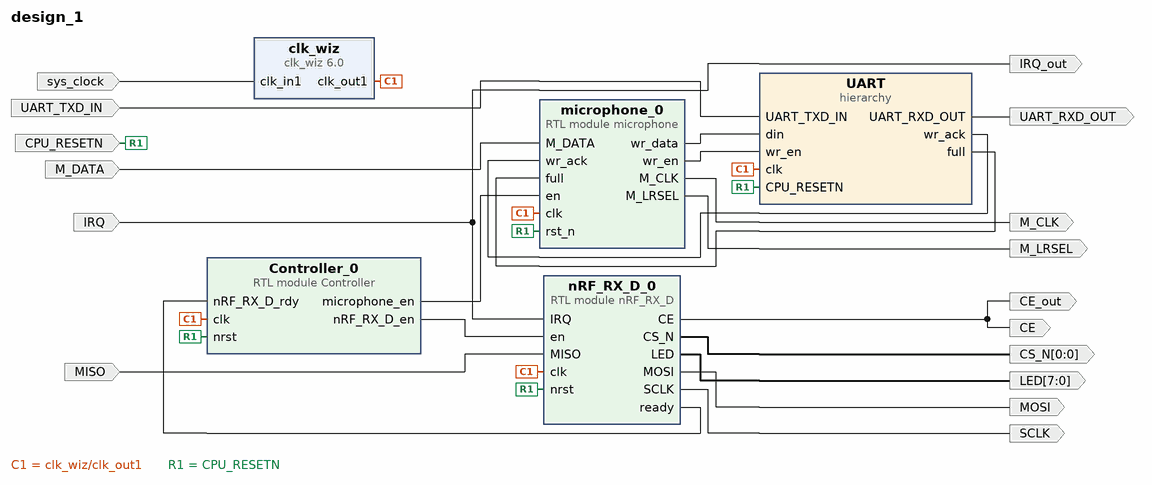
[diagram p0: block diagram of the top level]
# Vivado block design design_1, xc7a100tcsg324-1, Vivado 2020.2
create_bd_design design_1

create_bd_port -dir O UART_RXD_OUT
create_bd_port -dir I UART_TXD_IN
create_bd_port -dir I M_DATA
create_bd_port -dir O -type clk M_CLK
create_bd_port -dir O M_LRSEL
create_bd_port -dir I -type clk sys_clock
set_property -dict {CONFIG.FREQ_HZ 100000000 CONFIG.PHASE 0.000} [get_bd_ports sys_clock]
create_bd_port -dir I -type rst CPU_RESETN
create_bd_port -dir O -from 7 -to 0 LED
create_bd_port -dir O CE
create_bd_port -dir O -from 0 -to 0 CS_N
create_bd_port -dir I -type intr IRQ
create_bd_port -dir I MISO
create_bd_port -dir O MOSI
create_bd_port -dir O SCLK
create_bd_port -dir O IRQ_out
create_bd_port -dir O CE_out

create_bd_cell -type module -reference Controller Controller_0
create_bd_cell -type module -reference microphone microphone_0
create_bd_cell -type ip -vlnv xilinx.com:ip:clk_wiz:6.0 clk_wiz
set_property -dict [list \
  CONFIG.CLK_IN1_BOARD_INTERFACE sys_clock \
  CONFIG.USE_BOARD_FLOW true \
  CONFIG.USE_LOCKED false \
  CONFIG.USE_RESET false \
] [get_bd_cells clk_wiz]
create_bd_cell -type module -reference nRF_RX_D nRF_RX_D_0
create_bd_cell -type hier UART

# ---- hierarchy /UART ----
current_bd_instance /UART
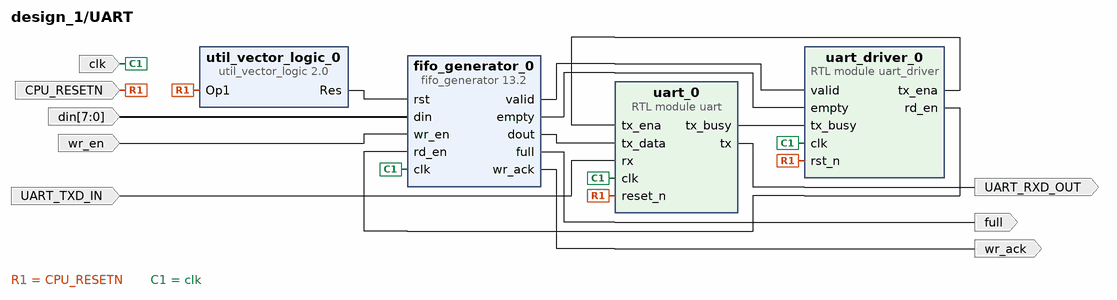
[diagram p1: block diagram inside /UART]
create_bd_pin -dir I -type rst CPU_RESETN
create_bd_pin -dir I -type clk clk
create_bd_pin -dir I -from 7 -to 0 din
create_bd_pin -dir I wr_en
create_bd_pin -dir O full
create_bd_pin -dir O wr_ack
create_bd_pin -dir I UART_TXD_IN
create_bd_pin -dir O UART_RXD_OUT

create_bd_cell -type ip -vlnv xilinx.com:ip:util_vector_logic:2.0 util_vector_logic_0
set_property -dict {CONFIG.C_OPERATION not CONFIG.C_SIZE 1} [get_bd_cells util_vector_logic_0]
create_bd_cell -type module -reference uart_driver uart_driver_0
create_bd_cell -type ip -vlnv xilinx.com:ip:fifo_generator:13.2 fifo_generator_0
set_property -dict [list \
  CONFIG.Fifo_Implementation Common_Clock_Builtin_FIFO \
  CONFIG.Input_Data_Width 8 \
  CONFIG.Input_Depth 2048 \
  CONFIG.Valid_Flag true \
  CONFIG.Write_Acknowledge_Flag true \
] [get_bd_cells fifo_generator_0]
create_bd_cell -type module -reference uart uart_0

# ---- connections ----

current_bd_instance /UART
connect_bd_net [get_bd_pins util_vector_logic_0/Res] [get_bd_pins fifo_generator_0/rst]
connect_bd_net [get_bd_pins fifo_generator_0/valid] [get_bd_pins uart_driver_0/valid]
connect_bd_net [get_bd_pins fifo_generator_0/empty] [get_bd_pins uart_driver_0/empty]
connect_bd_net [get_bd_pins uart_driver_0/rd_en] [get_bd_pins fifo_generator_0/rd_en]
connect_bd_net [get_bd_pins uart_0/tx_busy] [get_bd_pins uart_driver_0/tx_busy]
connect_bd_net [get_bd_pins uart_driver_0/tx_ena] [get_bd_pins uart_0/tx_ena]
connect_bd_net [get_bd_pins fifo_generator_0/dout] [get_bd_pins uart_0/tx_data]
connect_bd_net [get_bd_pins CPU_RESETN] [get_bd_pins uart_driver_0/rst_n] [get_bd_pins uart_0/reset_n] [get_bd_pins util_vector_logic_0/Op1]
connect_bd_net [get_bd_pins clk] [get_bd_pins uart_0/clk] [get_bd_pins fifo_generator_0/clk] [get_bd_pins uart_driver_0/clk]
connect_bd_net -net microphone_0_wr_data [get_bd_pins din] [get_bd_pins fifo_generator_0/din]
connect_bd_net -net microphone_0_wr_en [get_bd_pins wr_en] [get_bd_pins fifo_generator_0/wr_en]
connect_bd_net [get_bd_pins fifo_generator_0/full] [get_bd_pins full]
connect_bd_net [get_bd_pins fifo_generator_0/wr_ack] [get_bd_pins wr_ack]
connect_bd_net -net rx_0_1 [get_bd_pins UART_TXD_IN] [get_bd_pins uart_0/rx]
connect_bd_net [get_bd_pins uart_0/tx] [get_bd_pins UART_RXD_OUT]

current_bd_instance /
connect_bd_net [get_bd_pins clk_wiz/clk_out1] \
  [get_bd_pins microphone_0/clk] [get_bd_pins Controller_0/clk] [get_bd_pins nRF_RX_D_0/clk] [get_bd_pins UART/clk]
connect_bd_net [get_bd_ports CPU_RESETN] \
  [get_bd_pins microphone_0/rst_n] [get_bd_pins Controller_0/nrst] [get_bd_pins nRF_RX_D_0/nrst] \
  [get_bd_pins UART/CPU_RESETN]
connect_bd_net [get_bd_pins microphone_0/wr_data] [get_bd_pins UART/din]
connect_bd_net [get_bd_pins microphone_0/wr_en] [get_bd_pins UART/wr_en]
connect_bd_net -net uart_0_tx [get_bd_pins UART/UART_RXD_OUT] [get_bd_ports UART_RXD_OUT]
connect_bd_net -net rx_0_1 [get_bd_ports UART_TXD_IN] [get_bd_pins UART/UART_TXD_IN]
connect_bd_net [get_bd_pins Controller_0/microphone_en] [get_bd_pins microphone_0/en]
connect_bd_net -net fifo_generator_0_wr_ack [get_bd_pins UART/wr_ack] [get_bd_pins microphone_0/wr_ack]
connect_bd_net -net fifo_generator_0_full [get_bd_pins UART/full] [get_bd_pins microphone_0/full]
connect_bd_net -net M_DATA_0_1 [get_bd_ports M_DATA] [get_bd_pins microphone_0/M_DATA]
connect_bd_net [get_bd_pins microphone_0/M_CLK] [get_bd_ports M_CLK]
connect_bd_net [get_bd_pins microphone_0/M_LRSEL] [get_bd_ports M_LRSEL]
connect_bd_net [get_bd_ports sys_clock] [get_bd_pins clk_wiz/clk_in1]
connect_bd_net [get_bd_pins Controller_0/nRF_RX_D_en] [get_bd_pins nRF_RX_D_0/en]
connect_bd_net [get_bd_pins nRF_RX_D_0/ready] [get_bd_pins Controller_0/nRF_RX_D_rdy]
connect_bd_net [get_bd_pins nRF_RX_D_0/LED] [get_bd_ports LED]
connect_bd_net [get_bd_pins nRF_RX_D_0/CE] [get_bd_ports CE] [get_bd_ports CE_out]
connect_bd_net [get_bd_pins nRF_RX_D_0/CS_N] [get_bd_ports CS_N]
connect_bd_net -net IRQ_0_1 [get_bd_ports IRQ] [get_bd_pins nRF_RX_D_0/IRQ] [get_bd_ports IRQ_out]
connect_bd_net -net MISO_0_1 [get_bd_ports MISO] [get_bd_pins nRF_RX_D_0/MISO]
connect_bd_net [get_bd_pins nRF_RX_D_0/MOSI] [get_bd_ports MOSI]
connect_bd_net [get_bd_pins nRF_RX_D_0/SCLK] [get_bd_ports SCLK]

validate_bd_design
save_bd_design
